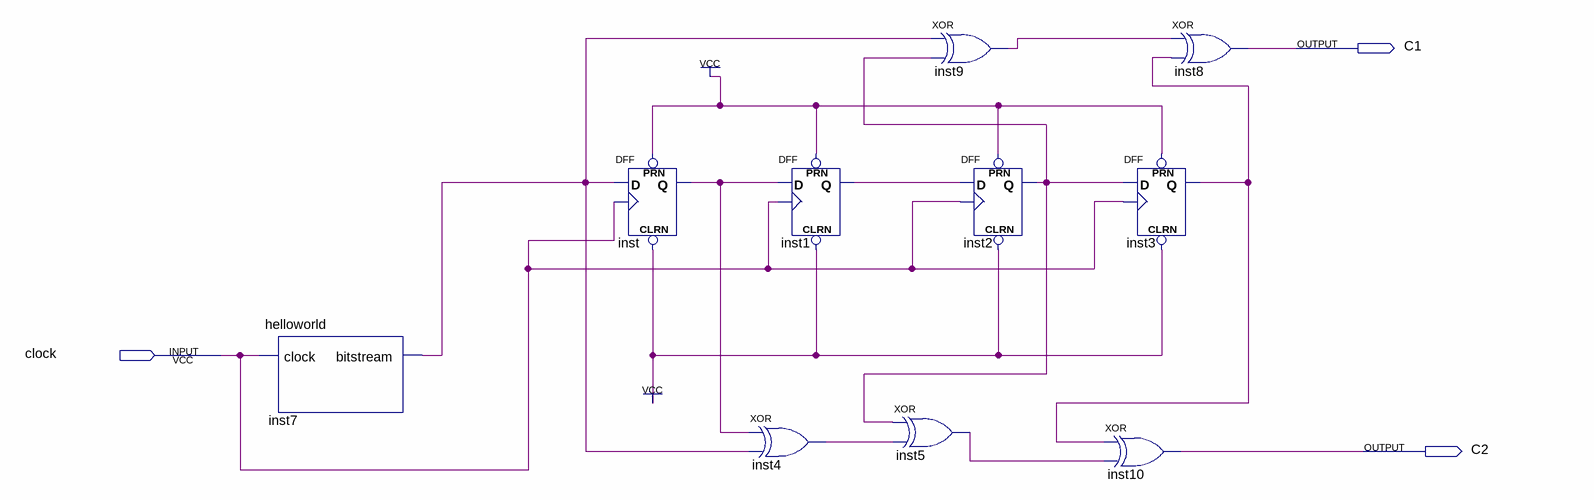
[diagram p0: schematic sheet]
// Quartus schematic half_rate_decoder.bdf as structural Verilog: 10 symbols, 3 pins
module half_rate_decoder (
  input  clock,
  output C1,
  output C2
);

  wire inst1_q, inst2_q, inst3_q, inst4_out, inst5_out, inst7_bitstream, inst9_out, inst_q;

  helloworld inst7 (.clock(clock), .bitstream(inst7_bitstream));
  DFF inst (.CLRN(1'b1), .CLK(clock), .D(inst7_bitstream), .PRN(1'b1), .Q(inst_q));
  xor inst4 (inst4_out, inst_q, inst7_bitstream);
  DFF inst1 (.CLRN(1'b1), .CLK(clock), .D(inst_q), .PRN(1'b1), .Q(inst1_q));
  xor inst5 (inst5_out, inst2_q, inst4_out);
  xor inst9 (inst9_out, inst7_bitstream, inst2_q);
  DFF inst2 (.CLRN(1'b1), .CLK(clock), .D(inst1_q), .PRN(1'b1), .Q(inst2_q));
  DFF inst3 (.CLRN(1'b1), .CLK(clock), .D(inst2_q), .PRN(1'b1), .Q(inst3_q));
  xor inst10 (C2, inst3_q, inst5_out);
  xor inst8 (C1, inst9_out, inst3_q);
endmodule
